# EAGLE design lpc1343-mega32 (EAGLE 5.10)
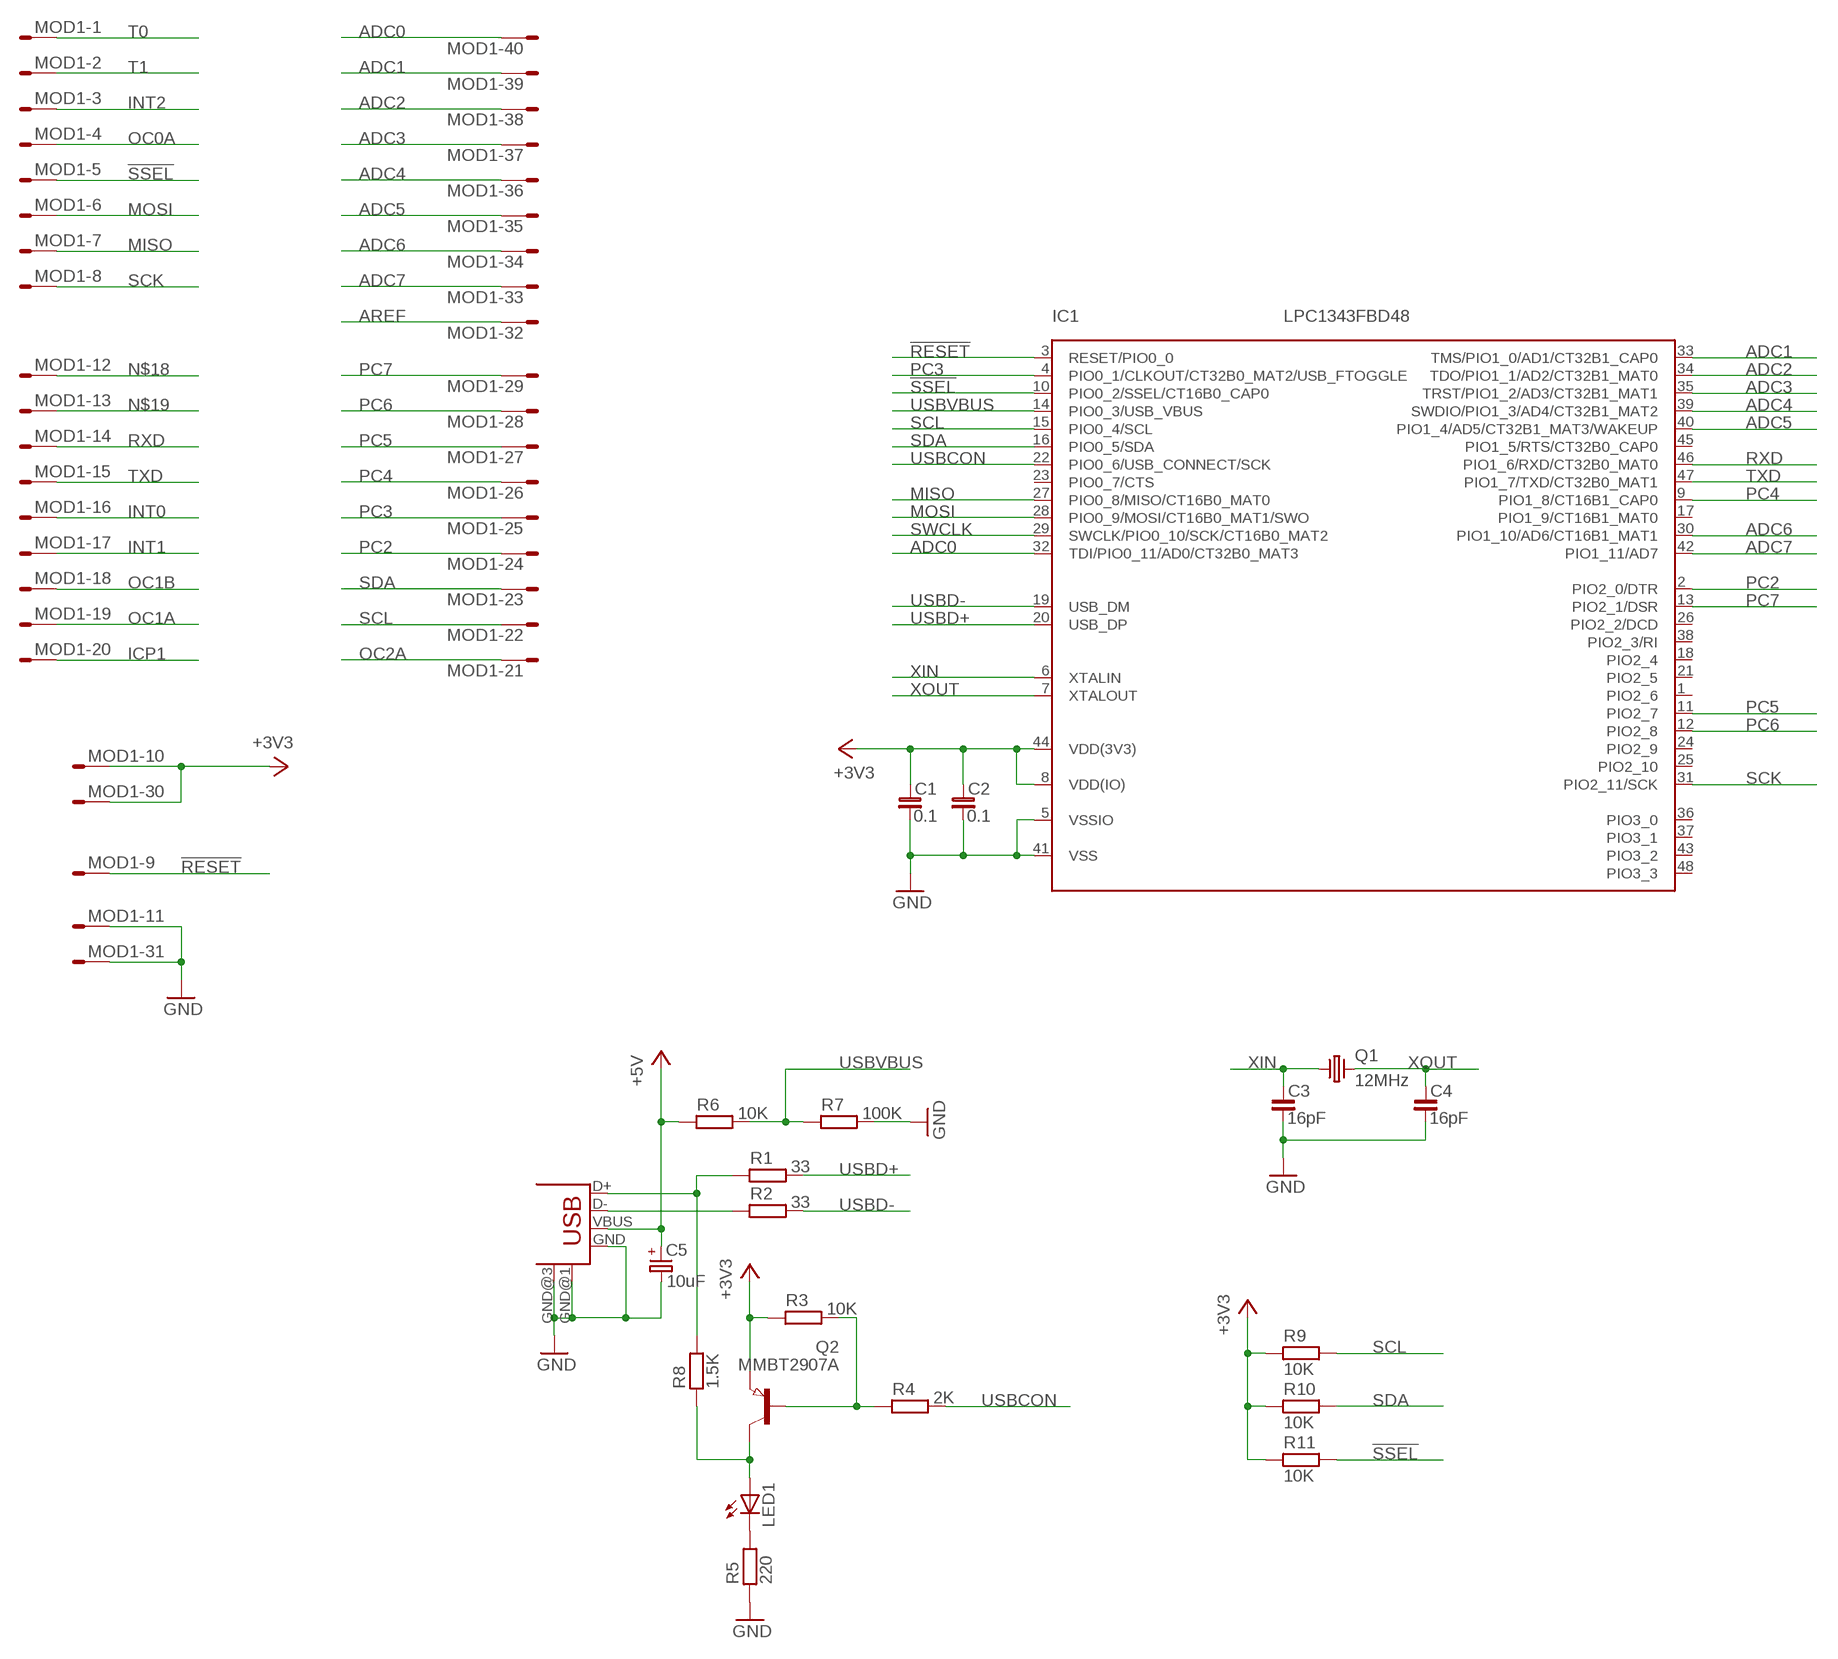
[diagram p0: schematic, sheet 1]

## Parts
C1  0.1  C_0603  [C0603]
C2  0.1  C_0603  [C0603]
C3  16pF  C_0603  [C0603]
C4  16pF  C_0603  [C0603]
C5  10uF  CP_SMCA  [SMC_A]
IC1  LPC1343FBD48  [LQFP48-7X7]
LED1  LEDCHIP-LED0603  [CHIP-LED0603]
MOD1  40E  [40P]
Q1  12MHz  CRYSTAL-HC49S  [HC49/S]
Q2  MMBT2907A  PNP-TRANSISTOR_SOT23  [SOT23]
R1  33  R_0603  [R0603]
R2  33  R_0603  [R0603]
R3  10K  R_0603  [R0603]
R4  2K  R_0603  [R0603]
R5  220  R_0603  [R0603]
R6  10K  R_0603  [R0603]
R7  100K  R_0603  [R0603]
R8  1.5K  R_0603  [R0603]
R9  10K  R_0603  [R0603]
R10  10K  R_0603  [R0603]
R11  10K  R_0603  [R0603]
USB1  USB-MB-S2  [USB-MB-S2]

## Nets
!RESET: IC1.3(RESET/PIO0_0) MOD1.9
!SSEL: IC1.10(PIO0_2/SSEL/CT16B0_CAP0) MOD1.5 R11.2
+3V3: C1.1 C2.1 IC1.8(VDD(IO)) IC1.44(VDD(3V3)) MOD1.10 MOD1.30 Q2.2(E) R3.1 R9.1 R10.1 R11.1
+5V: C5.+ R6.1 USB1.VBUS
ADC0: IC1.32(TDI/PIO0_11/AD0/CT32B0_MAT3) MOD1.40
ADC1: IC1.33(TMS/PIO1_0/AD1/CT32B1_CAP0) MOD1.39
ADC2: IC1.34(TDO/PIO1_1/AD2/CT32B1_MAT0) MOD1.38
ADC3: IC1.35(TRST/PIO1_2/AD3/CT32B1_MAT1) MOD1.37
ADC4: IC1.39(SWDIO/PIO1_3/AD4/CT32B1_MAT2) MOD1.36
ADC5: IC1.40(PIO1_4/AD5/CT32B1_MAT3/WAKEUP) MOD1.35
ADC6: IC1.30(PIO1_10/AD6/CT16B1_MAT1) MOD1.34
ADC7: IC1.42(PIO1_11/AD7) MOD1.33
AREF: MOD1.32
GND: C1.2 C2.2 C3.2 C4.2 C5.- IC1.5(VSSIO) IC1.41(VSS) MOD1.11 MOD1.31 R5.1 R7.2 USB1.GND USB1.GND@1(GND) USB1.GND@3(GND)
ICP1: MOD1.20
INT0: MOD1.16
INT1: MOD1.17
INT2: MOD1.3
MISO: IC1.27(PIO0_8/MISO/CT16B0_MAT0) MOD1.7
MOSI: IC1.28(PIO0_9/MOSI/CT16B0_MAT1/SWO) MOD1.6
N$1: R2.1 USB1.D-
N$2: LED1.C R5.2
N$3: LED1.A Q2.3(C) R8.1
N$5: Q2.1(B) R3.2 R4.1
N$7: R1.1 R8.2 USB1.D+
N$18: MOD1.12
N$19: MOD1.13
OC0A: MOD1.4
OC1A: MOD1.19
OC1B: MOD1.18
OC2A: MOD1.21
PC2: IC1.2(PIO2_0/DTR) MOD1.24
PC3: IC1.4(PIO0_1/CLKOUT/CT32B0_MAT2/USB_FTOGGLE) MOD1.25
PC4: IC1.9(PIO1_8/CT16B1_CAP0) MOD1.26
PC5: IC1.11(PIO2_7) MOD1.27
PC6: IC1.12(PIO2_8) MOD1.28
PC7: IC1.13(PIO2_1/DSR) MOD1.29
RXD: IC1.46(PIO1_6/RXD/CT32B0_MAT0) MOD1.14
SCK: IC1.31(PIO2_11/SCK) MOD1.8
SCL: IC1.15(PIO0_4/SCL) MOD1.22 R9.2
SDA: IC1.16(PIO0_5/SDA) MOD1.23 R10.2
SWCLK: IC1.29(SWCLK/PIO0_10/SCK/CT16B0_MAT2)
T0: MOD1.1
T1: MOD1.2
TXD: IC1.47(PIO1_7/TXD/CT32B0_MAT1) MOD1.15
USBCON: IC1.22(PIO0_6/USB_CONNECT/SCK) R4.2
USBD+: IC1.20(USB_DP) R1.2
USBD-: IC1.19(USB_DM) R2.2
USBVBUS: IC1.14(PIO0_3/USB_VBUS) R6.2 R7.1
XIN: C3.1 IC1.6(XTALIN) Q1.1
XOUT: C4.1 IC1.7(XTALOUT) Q1.2
Unconnected: IC1.1(PIO2_6) IC1.17(PIO1_9/CT16B1_MAT0) IC1.18(PIO2_4) IC1.21(PIO2_5) IC1.23(PIO0_7/CTS) IC1.24(PIO2_9) IC1.25(PIO2_10) IC1.26(PIO2_2/DCD) IC1.36(PIO3_0) IC1.37(PIO3_1) IC1.38(PIO2_3/RI) IC1.43(PIO3_2) IC1.45(PIO1_5/RTS/CT32B0_CAP0) IC1.48(PIO3_3)

## Library data of the parts
C1-C4 = rc-master-smd:C_: NON-POLARIZED CAP
C5 = rc-master-smd:CP_: POLARIZED CAP
IC1 = lpc1xxx-v6:LPC1343FBD48: LPC1343 72 MHz 32-bit ARM Cortex-M3 based microcontroller featuring a high level of integration and low power consumption. 32 kB Flash, 8 kB SRAM, USB Device MarcVl - Datasheet available on www.nxp.com
LED1 = led:LED: LED OSRAM: - CHIPLED LG R971, LG N971, LY N971, LG Q971, LY Q971, LO R971, LY R971 LH N974, LH R974 LS Q976, LO Q976, LY Q976 LO Q996 - Hyper CHIPLED LW Q18S LB Q993, LB Q99A, LB R99A - SideLED LS A670, LO A670, LY A670, LG A670, LP A670 LB A673, LV A673, LT A673, LW A673 LH A674 LY A675 LS A676, LA A676, LO A676, LY A676, LW A676 LS A679, LY A679, LG A679 - Hyper Micro SIDELED® LS Y876, LA Y876, LO Y876, LY Y876 LT Y87S - SmartLED LW L88C, LW L88S LB L89C, LB L89S, LG L890 LS L89K, LO L89K, LY L89K LS L896, LA L896, LO L896, LY L896 - TOPLED LS T670, LO T670, LY T670, LG T670, LP T670 LSG T670, LSP T670, LSY T670, LOP T670, LYG T670 LG T671, LOG T671, LSG T671 LB T673, LV T673, LT T673, LW T673 LH T674 LS T676, LA T676, LO T676, LY T676, LB T676, LH T676, LSB T676, LW T676 LB T67C, LV T67C, LT T67C, LS T67K, LO T67K, LY T67K, LW E67C LS E67B, LA E67B, LO E67B, LY E67B, LB E67C, LV E67C, LT E67C LW T67C LS T679, LY T679, LG T679 LS T770, LO T770, LY T770, LG T770, LP T770 LB T773, LV T773, LT T773, LW T773 LH T774 LS E675, LA E675, LY E675, LS T675 LS T776, LA T776, LO T776, LY T776, LB T776 LHGB T686 LT T68C, LB T68C - Hyper Mini TOPLED® LB M676 - Mini TOPLED Santana® LG M470 LS M47K, LO M47K, LY M47K Source: http://www.osram.convergy.de - LUMILED® LXK2-PW12-R00, LXK2-PW12-S00, LXK2-PW14-U00, LXK2-PW14-V00 LXK2-PM12-R00, LXK2-PM12-S00, LXK2-PM14-U00 LXK2-PE12-Q00, LXK2-PE12-R00, LXK2-PE12-S00, LXK2-PE14-T00, LXK2-PE14-U00 LXK2-PB12-K00, LXK2-PB12-L00, LXK2-PB12-M00, LXK2-PB14-N00, LXK2-PB14-P00, LXK2-PB14-Q00 LXK2-PR12-L00, LXK2-PR12-M00, LXK2-PR14-Q00, LXK2-PR14-R00 LXK2-PD12-Q00, LXK2-PD12-R00, LXK2-PD12-S00 LXK2-PH12-R00, LXK2-PH12-S00 LXK2-PL12-P00, LXK2-PL12-Q00, LXK2-PL12-R00 Source: www.luxeon.com
MOD1 = misc:40E: DIL CABLE CONNECTOR
Q1 = crystal:CRYSTAL-: CRYSTAL
Q2 = semicon-smd-ipc:PNP-TRANSISTOR_: PNP TRANSISTOR
R1-R11 = rc-master-smd:R_: RESISTOR
USB1 = usb:USB: USB Connectors

## Board
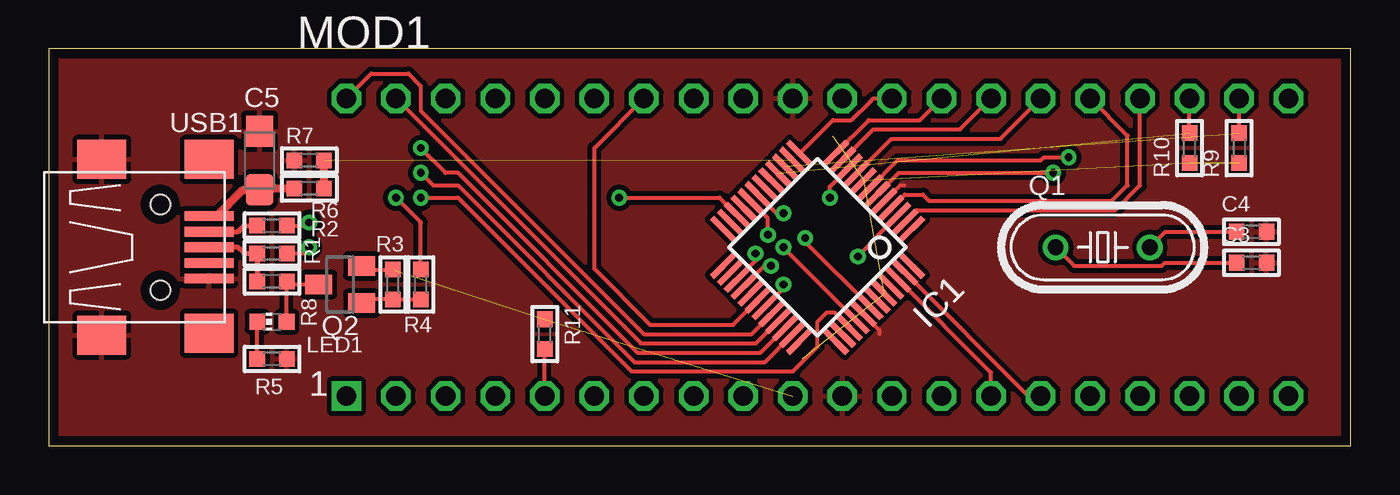
[diagram p1: board, top side]
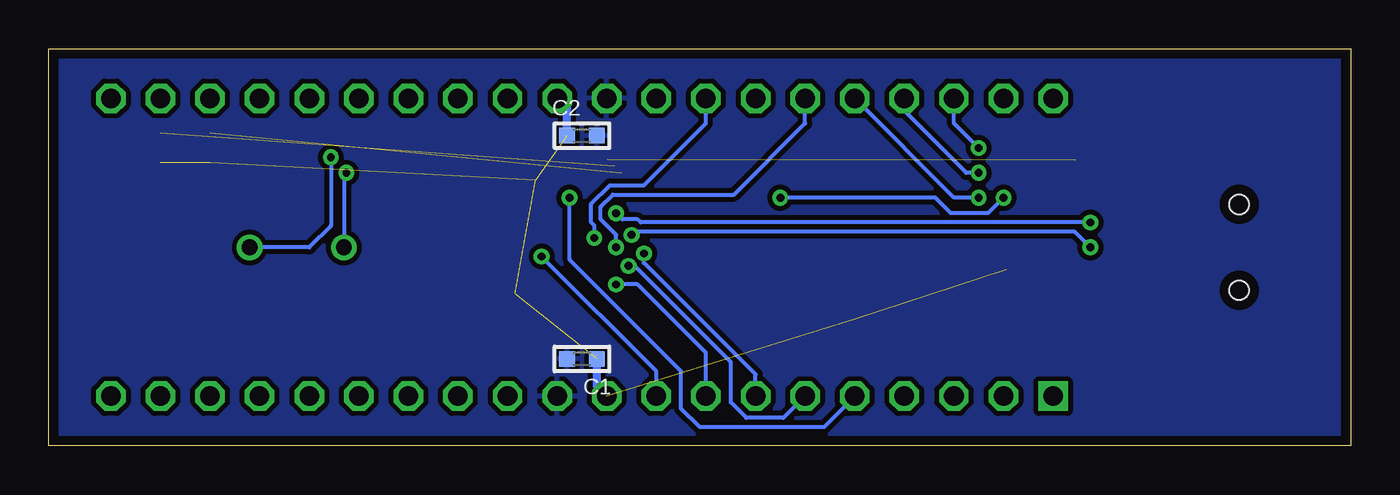
[diagram p2: board, bottom side, seen from below]

Size 66.67 x 20.32 mm. Coordinates in mm from the lower left corner, seen from the top.
Outline: 0,0 66.67,0 66.67,20.32 0,20.32 0,0
Copper layers (1*16): Top 0.018mm / dielectric 1.5mm / Bottom 0.018mm
Design rules "default *": minimum track width 0.15mm, minimum drill 0.4mm, track to track 0.15mm, track to pad 0.15mm, pad to pad 0.15mm, via to via 0.15mm, smd to smd 0.15mm, copper to edge 0.5mm, drill to drill 8mil, minimum pad ring 10mil, minimum via ring 8mil, stop-mask expansion 4mil, vias tented up to drill 0mil, thermal gap 10mil

### Footprints (pad centres in the part's own frame; a part is rotated, then mirrored left to right if it is on the bottom)
C0603 = smd 0.8 x 0.8: 1 -0.762,0; 2 0.762,0
SMC_A = smd 1.6 x 1.4: + -1.5,0; - 1.5,0
LQFP48-7X7 = smd 0.3 x 1.6: 1 -2.75,-4.1; 2 -2.25,-4.1; 3 -1.75,-4.1; 4 -1.25,-4.1; 5 -0.75,-4.1; 6 -0.25,-4.1; 7 0.25,-4.1; 8 0.75,-4.1; 9 1.25,-4.1; 10 1.75,-4.1; 11 2.25,-4.1; 12 2.75,-4.1; 25 2.75,4.1; 26 2.25,4.1; 27 1.75,4.1; 28 1.25,4.1; 29 0.75,4.1; 30 0.25,4.1; 31 -0.25,4.1; 32 -0.75,4.1; 33 -1.25,4.1; 34 -1.75,4.1; 35 -2.25,4.1; 36 -2.75,4.1 | smd 1.6 x 0.3: 13 4.1,-2.75; 14 4.1,-2.25; 15 4.1,-1.75; 16 4.1,-1.25; 17 4.1,-0.75; 18 4.1,-0.25; 19 4.1,0.25; 20 4.1,0.75; 21 4.1,1.25; 22 4.1,1.75; 23 4.1,2.25; 24 4.1,2.75; 37 -4.1,2.75; 38 -4.1,2.25; 39 -4.1,1.75; 40 -4.1,1.25; 41 -4.1,0.75; 42 -4.1,0.25; 43 -4.1,-0.25; 44 -4.1,-0.75; 45 -4.1,-1.25; 46 -4.1,-1.75; 47 -4.1,-2.25; 48 -4.1,-2.75
CHIP-LED0603 = smd 0.8 x 0.8: A 0,-0.75; C 0,0.75
40P = drill 1 square: 1 -24.13,-7.62 | drill 1 octagon: 2 -21.59,-7.62; 3 -19.05,-7.62; 4 -16.51,-7.62; 5 -13.97,-7.62; 6 -11.43,-7.62; 7 -8.89,-7.62; 8 -6.35,-7.62; 9 -3.81,-7.62; 10 -1.27,-7.62; 11 1.27,-7.62; 12 3.81,-7.62; 13 6.35,-7.62; 14 8.89,-7.62; 15 11.43,-7.62; 16 13.97,-7.62; 17 16.51,-7.62; 18 19.05,-7.62; 19 21.59,-7.62; 20 24.13,-7.62; 21 24.13,7.62; 22 21.59,7.62; 23 19.05,7.62; 24 16.51,7.62; 25 13.97,7.62; 26 11.43,7.62; 27 8.89,7.62; 28 6.35,7.62; 29 3.81,7.62; 30 1.27,7.62; 31 -1.27,7.62; 32 -3.81,7.62; 33 -6.35,7.62; 34 -8.89,7.62; 35 -11.43,7.62; 36 -13.97,7.62; 37 -16.51,7.62; 38 -19.05,7.62; 39 -21.59,7.62; 40 -24.13,7.62
HC49/S = drill 0.8 round: 1 -2.413,0; 2 2.413,0
SOT23 = smd 1 x 1.4: 1 -0.95,-1.1; 2 0.95,-1.1; 3 0,1.1
R0603 = smd 0.8 x 0.8: 1 -0.762,0; 2 0.762,0
USB-MB-S2 = smd 2.5 x 0.5: D+ 2.5,0; D- 2.5,0.8; GND 2.5,-1.6; ID 2.5,-0.8; VBUS 2.5,1.6 | smd 2.5 x 2: GND@1 -3,4.5; GND@2 2.5,4.5; GND@3 -3,-4.5; GND@4 2.5,-4.4 | hole 1: 0,2.2; 0,-2.2

### Placement (x,y rotation side)
C1  39.37,4.45 180 bottom
C2  39.37,15.88 0 bottom
C3  61.59,9.37 0 top
C4  61.59,10.95 0 top
C5  10.79,14.61 90 top
IC1  39.37,10.16 135 top
LED1  11.43,6.35 90 top
MOD1  39.37,10.16 0 top
Q1  53.98,10.16 0 top
Q2  14.92,8.26 90 top
R1  11.43,9.84 0 top
R2  11.43,11.27 0 top
R3  17.62,8.26 270 top
R4  19.05,8.26 90 top
R5  11.43,4.45 180 top
R6  13.34,13.18 0 top
R7  13.34,14.61 180 top
R8  11.43,8.41 180 top
R9  60.96,15.24 90 top
R10  58.42,15.24 90 top
R11  25.4,5.71 270 top
USB1  5.71,10.16 0 top

### Tracks (layer width: path | path; a pad name or v marks a point on that pad's centre or on a via)
!RESET  (via drill 0.4)
  Top 0.203: IC1.3 42.64,10.95 v41.43,9.68
  Bottom 0.203: v41.43,9.68 35.56,3.81 MOD1.9
!SSEL  (via drill 0.4)
  Top 0.203: IC1.10 40.01,13.27 v40.01,12.7 | MOD1.5 R11.2
  Bottom 0.203: v40.01,12.7 40.01,9.53 34.29,3.81 34.29,1.91 33.34,0.95 26.99,0.95 MOD1.5
+3V3  (7 unrouted)
  Top 0.203: R3.1 16.21,9.02 Q2.2
  Bottom 0.406: C1.1 38.61,3.05 MOD1.10 | C2.1 40.13,17.27 MOD1.30
+5V
  Top 0.406: USB1.VBUS 8.59,11.76 9.93,13.11 C5.+ 10.87,13.18 R6.1
ADC0
  Top 0.203: IC1.32 35.99,5.71 30.48,5.71 19.05,17.14 19.05,18.41 18.41,19.05 16.51,19.05 MOD1.40
ADC1
  Top 0.203: IC1.33 36.22,5.24 30.32,5.24 MOD1.39
ADC2  (via drill 0.4)
  Top 0.203: IC1.34 36.45,4.76 30.16,4.76 20.95,13.97 20.32,13.97 v19.05,15.24
  Bottom 0.203: v19.05,15.24 20.32,16.51 MOD1.38
ADC3  (via drill 0.4)
  Top 0.203: IC1.35 36.67,4.29 30,4.29 20.95,13.34 19.68,13.34 v19.05,13.97
  Bottom 0.203: v19.05,13.97 19.68,13.97 22.86,17.14 MOD1.37
ADC4  (via drill 0.4)
  Top 0.203: IC1.39 40.23,6.83 39.85,6.83 39.37,6.35 39.37,5.08 38.1,3.81 29.84,3.81 20.95,12.7 v19.05,12.7
  Bottom 0.203: v19.05,12.7 20.32,12.7 MOD1.36
ADC5  (via drill 0.4)
  Top 0.203: IC1.40 38.1,9.66 v37.62,10.16
  Bottom 0.203: v37.62,10.16 37.62,10.79 38.42,11.59 38.42,12.22 37.78,12.86 31.59,12.86 27.94,16.51 MOD1.35
ADC6
  Top 0.203: IC1.30 35.05,6.19 30.8,6.19 27.94,9.05 27.94,14.61 27.94,15.24 MOD1.34
ADC7  (via drill 0.4)
  Top 0.203: IC1.42 38.73,10.44 v38.73,10.64
  Bottom 0.203: MOD1.33 33.02,16.51 36.2,13.34 37.94,13.34 38.89,12.38 38.89,11.43 38.73,11.27 v38.73,10.64
GND
  Top 0.203: IC1.5 43.61,13.34 43.81,13.34 | IC1.41 42.55,5.92 42.55,5.71
  pour Top (isolate 0.254): -0.64,20.95 67.31,20.95 67.31,-0.64 -0.64,-0.64
  pour Bottom (isolate 0.254): -0.64,20.95 67.31,20.95 67.31,-0.64 -0.64,-0.64
MISO  (via drill 0.4)
  Top 0.203: IC1.27 36.2,9.46 v36.2,9.84
  Bottom 0.203: v36.2,9.84 36.2,9.37 30.48,3.65 MOD1.7
MOSI  (via drill 0.4)
  Top 0.203: IC1.28 36.65,9.21 v36.99,9.21
  Bottom 0.203: MOD1.6 29.05,1.43 30.96,1.43 31.75,2.22 31.75,4.29 36.67,9.21 v36.99,9.21
N$1
  Top 0.254: USB1.D- 9.69,10.96 10,11.27 R2.1
N$2
  Top 0.203: LED1.C R5.2
N$3
  Top 0.203: LED1.A R8.1 12.35,8.26 Q2.3
N$5
  Top 0.203: R4.1 R3.2 16.21,7.49 Q2.1
N$7
  Top 0.254: USB1.D+ 9.68,10.16 10,9.84 R1.1 R8.2
PC2
  Top 0.203: IC1.2 44.46,12.06 54.61,12.06 55.88,13.34 MOD1.24
PC3
  Top 0.203: IC1.4 43.84,12.86 44.77,12.86 45.09,12.54 54.45,12.54 55.24,13.34 55.24,15.88 MOD1.25
PC4
  Top 0.203: IC1.9 43.16,15.72 48.74,15.72 MOD1.26
PC5
  Top 0.203: IC1.11 42.22,16.19 46.67,16.19 MOD1.27
PC6
  Top 0.203: IC1.12 41.99,16.67 44.61,16.67 MOD1.28
PC7
  Top 0.203: IC1.13 38.5,15 40.16,16.67 41.12,16.67 42.07,17.62 42.23,17.78 MOD1.29
RXD
  Top 0.203: IC1.46 48.26,3.75 MOD1.14
SCK  (via drill 0.4)
  Top 0.203: IC1.31 37.82,8.26 v37.62,8.26
  Bottom 0.203: v37.62,8.26 36.51,8.26 33.02,4.76 MOD1.8
SCL  (1 unrouted)
  Top 0.203: R9.2 MOD1.22
SDA  (1 unrouted)
  Top 0.203: R10.2 MOD1.23
TXD
  Top 0.203: IC1.47 50.17,2.54 MOD1.15
USBCON  (via drill 0.4)
  Top 0.203: IC1.22 34.35,12.7 v29.21,12.7 | v17.78,12.7 19.05,11.43 R4.2
  Bottom 0.203: v29.21,12.7 21.27,12.7 20.48,11.91 18.57,11.91 v17.78,12.7
USBD+  (via drill 0.4)
  Top 0.203: IC1.20 36.72,11.75 36.83,11.64 v36.83,10.79 | v13.34,10.16 13.02,9.84 R1.2
  Bottom 0.203: v36.83,10.79 | v36.83,10.79 36.67,10.95 14.13,10.95 v13.34,10.16
USBD-  (via drill 0.4)
  Top 0.203: IC1.19 37.27,11.91 v37.62,11.91 | v13.34,11.43 13.18,11.27 R2.2
  Bottom 0.203: v37.62,11.91 37.31,11.59 36.51,11.59 36.35,11.43 v13.34,11.43
USBVBUS  (1 unrouted)
  Top 0.406: R6.2 R7.1
XIN  (via drill 0.4)
  Top 0.203: C3.1 57.15,9.37 56.99,9.21 52.51,9.21 Q1.1 | IC1.6 43.53,13.97 v51.44,13.97
  Bottom 0.203: v51.44,13.97 51.56,13.84 Q1.1
XOUT  (via drill 0.4)
  Top 0.203: C4.1 57.18,10.95 Q1.2 | IC1.7 43.46,14.61 50.8,14.61 50.96,14.76 v52.23,14.76
  Bottom 0.203: v52.23,14.76 52.23,11.27 53.34,10.16 Q1.2